# Altium schematic sheet Power.SchDoc
size A4
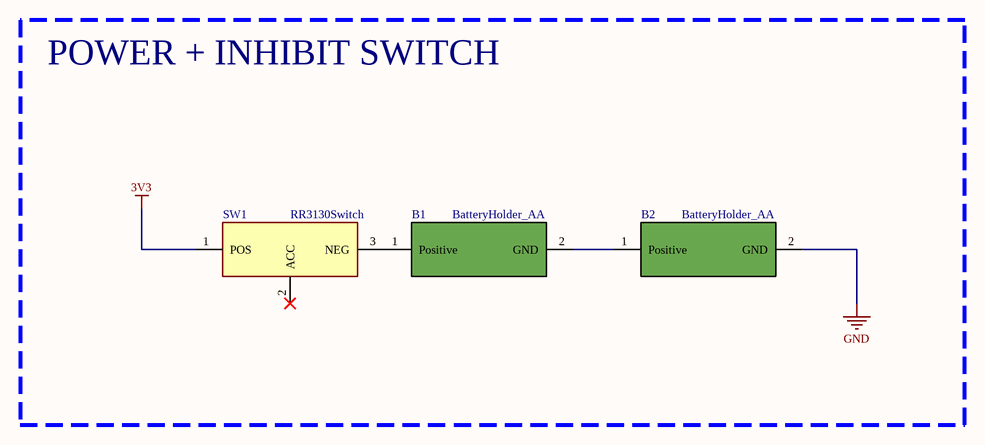
[diagram p0: Power.SchDoc]

## Parts
B1  BatteryHolder_AA  [BatteryHolder_AA]
B2  BatteryHolder_AA  [BatteryHolder_AA]
SW1  RR3130Switch  [RR3130Switch]

## Blocks framed on the sheet
POWER + INHIBIT SWITCH: B1 B2 SW1

## Nets
3V3: SW1.1(POS)
GND: B2.2(GND)
NetB1_1: B1.1(Positive) SW1.3(NEG)
NetB1_2: B1.2(GND) B2.1(Positive)

Not connected (* = marked no-connect by the designer): SW1 2(ACC)*

## Library data of the parts
B1 B2 = BatteryHolder_AA: Keystone Electronics 1088
SW1 = RR3130Switch: SWITCH ROCKER SPST 10A 125V